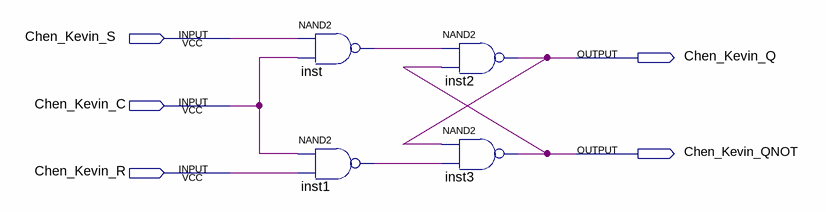
[diagram p0: schematic sheet]
// Quartus schematic Chen_Kevin_Control_SR-Latch.bdf as structural Verilog: 4 symbols, 5 pins
module \Chen_Kevin_Control_SR-Latch  (
  input  Chen_Kevin_S,
  input  Chen_Kevin_C,
  input  Chen_Kevin_R,
  output Chen_Kevin_Q,
  output Chen_Kevin_QNOT
);

  wire inst1_out, inst_out;

  nand inst (inst_out, Chen_Kevin_S, Chen_Kevin_C);
  nand inst1 (inst1_out, Chen_Kevin_C, Chen_Kevin_R);
  nand inst2 (Chen_Kevin_Q, inst_out, Chen_Kevin_QNOT);
  nand inst3 (Chen_Kevin_QNOT, Chen_Kevin_Q, inst1_out);
endmodule
